# Altium project BMU_v50.PrjPcb (part 2 of 5)

## Sheet BMU_V50_CellBalanceTaps.SchDoc
size C
Used 2 times, as channels StringA/U_BMU_V50_CellBalancer/U_BMU_V50_CellBalanceTaps, StringB/U_BMU_V50_CellBalancer/U_BMU_V50_CellBalanceTaps. Parts and nets are listed once, with the designators drawn on the sheet.
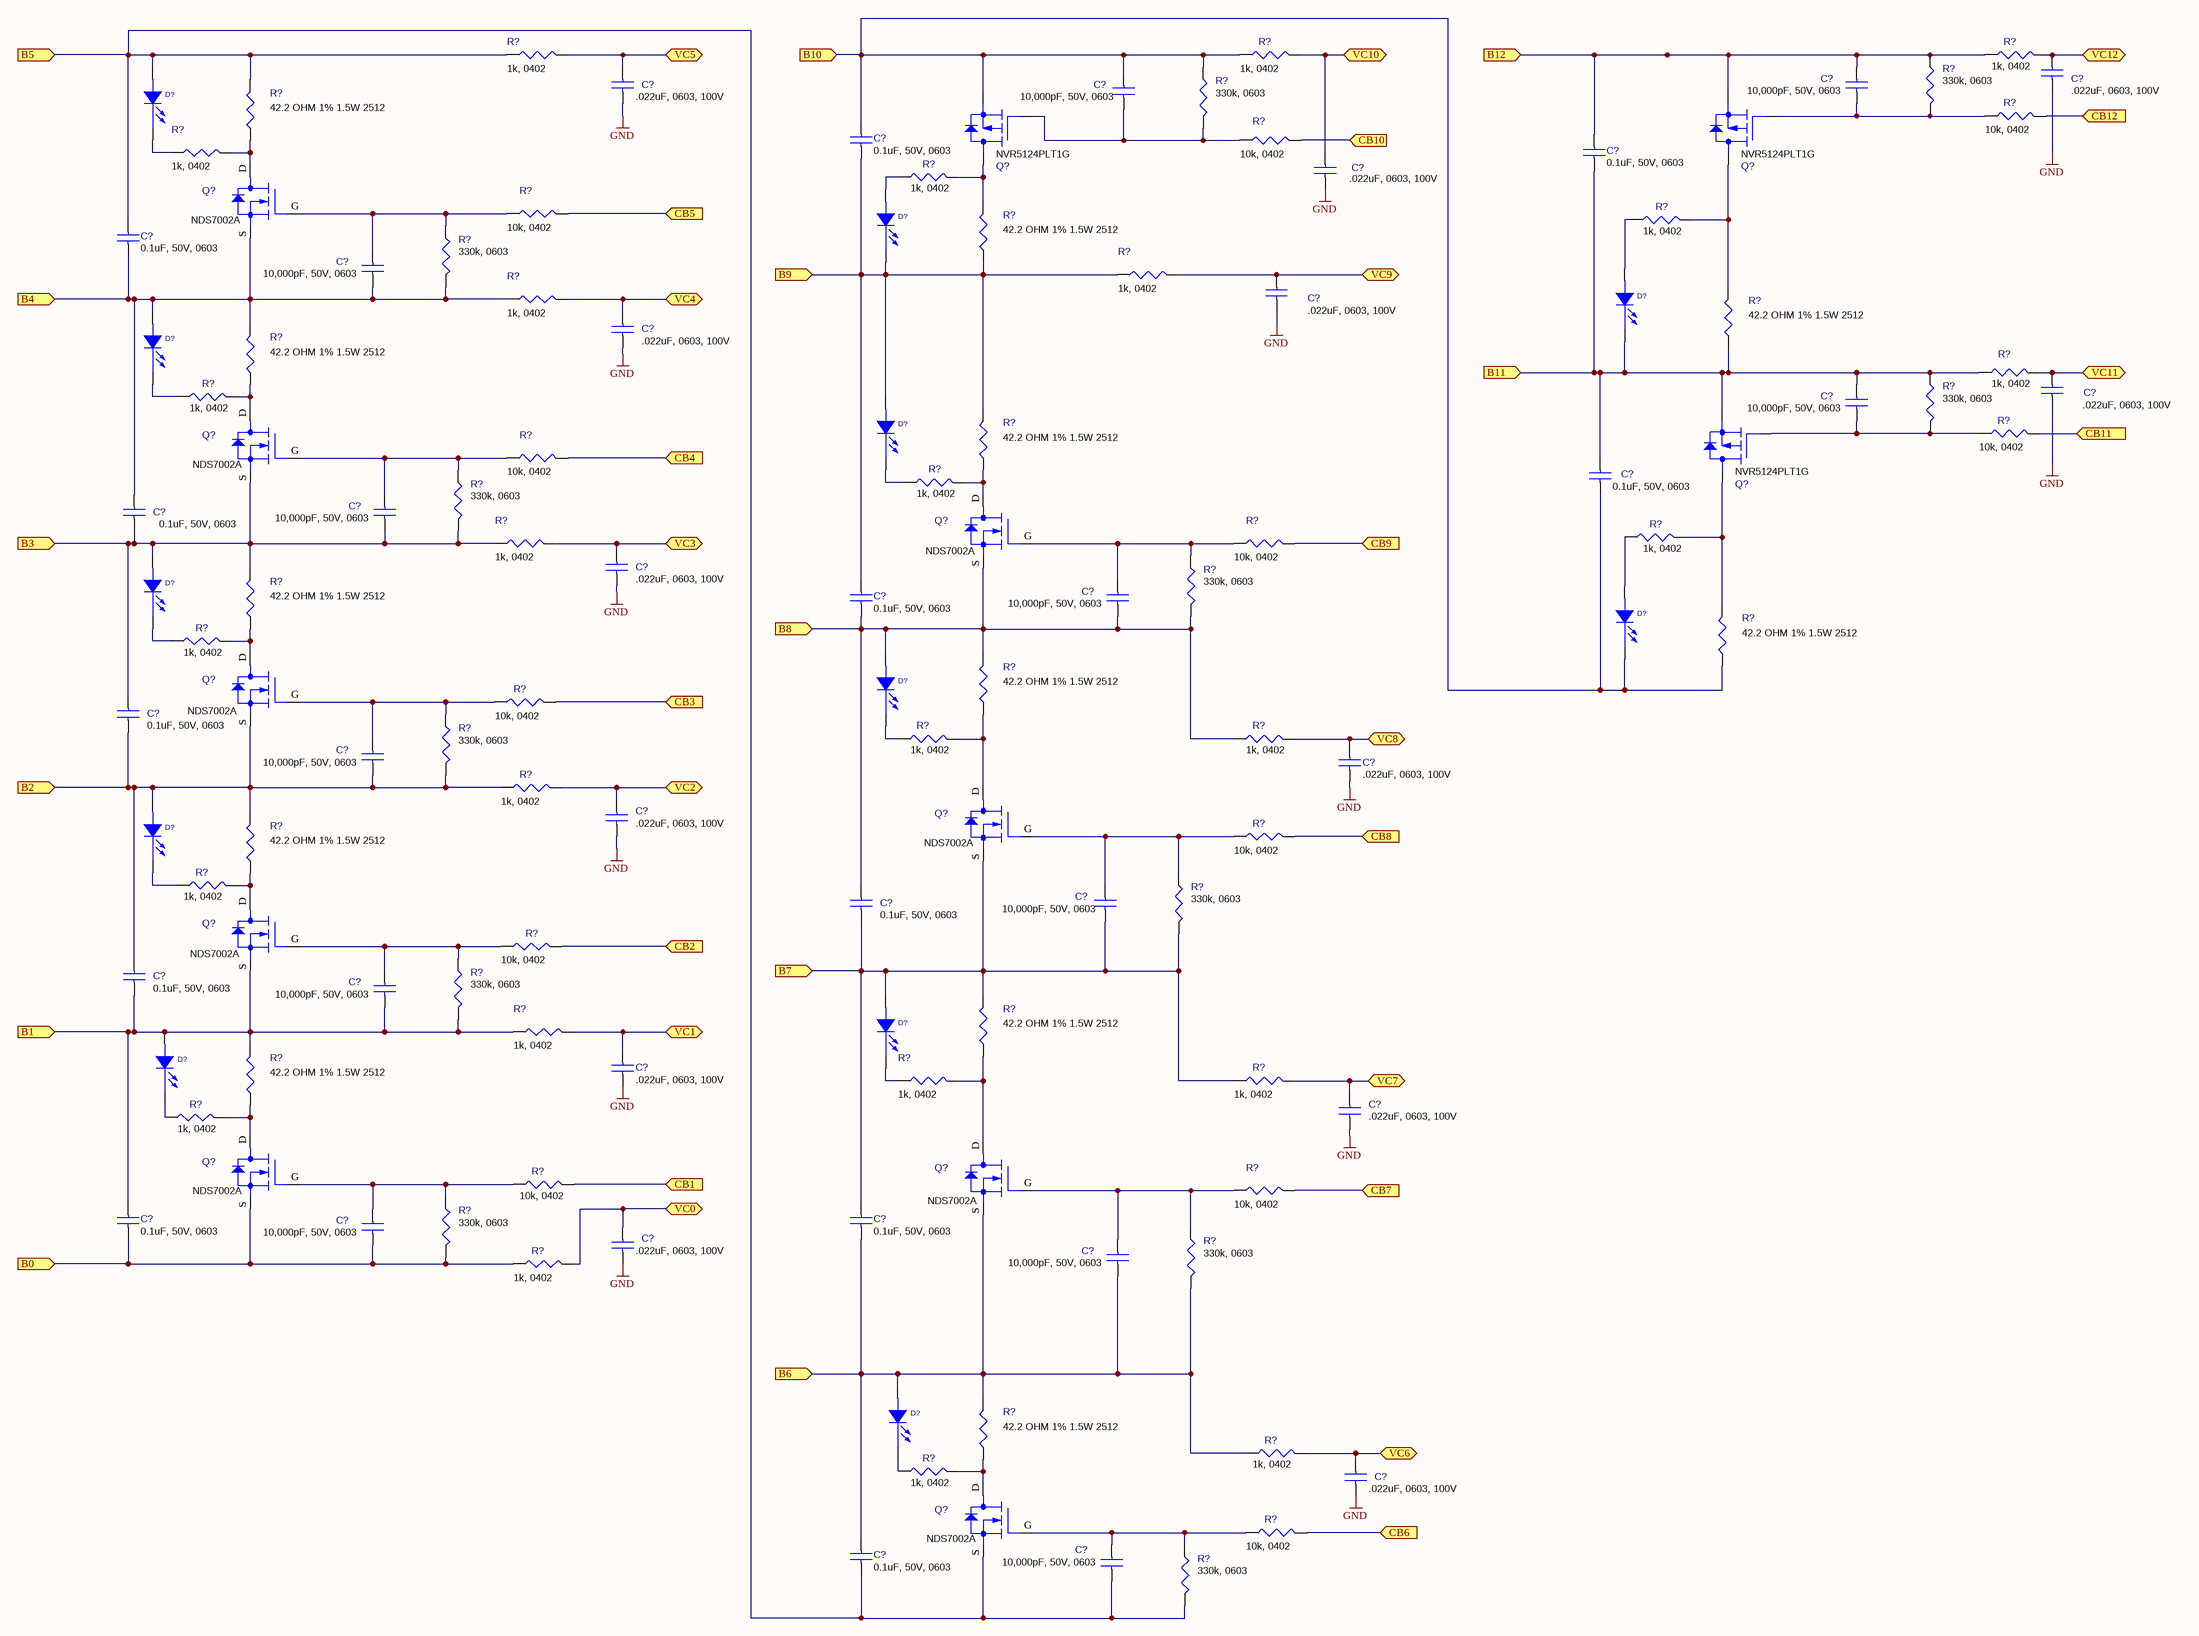
[diagram p5: BMU_V50_CellBalanceTaps.SchDoc]

### Parts
(Parts that share a designator on the sheet are numbered #1, #2 ... from top to bottom, then left to right.)
C?#1  .022uF, 0603, 100V  [C0603]
C?#2  .022uF, 0603, 100V  [C0603]
C?#3  10,000pF, 50V, 0603  [C0603]
C?#4  10,000pF, 50V, 0603  [C0603]
C?#5  0.1uF, 50V, 0603  [C0603]
C?#6  0.1uF, 50V, 0603  [C0603]
C?#7  .022uF, 0603, 100V  [C0603]
C?#8  0.1uF, 50V, 0603  [C0603]
C?#9  10,000pF, 50V, 0603  [C0603]
C?#10  .022uF, 0603, 100V  [C0603]
C?#11  .022uF, 0603, 100V  [C0603]
C?#12  .022uF, 0603, 100V  [C0603]
C?#13  10,000pF, 50V, 0603  [C0603]
C?#14  0.1uF, 50V, 0603  [C0603]
C?#15  0.1uF, 50V, 0603  [C0603]
C?#16  10,000pF, 50V, 0603  [C0603]
C?#17  .022uF, 0603, 100V  [C0603]
C?#18  0.1uF, 50V, 0603  [C0603]
C?#19  10,000pF, 50V, 0603  [C0603]
C?#20  0.1uF, 50V, 0603  [C0603]
C?#21  10,000pF, 50V, 0603  [C0603]
C?#22  .022uF, 0603, 100V  [C0603]
C?#23  .022uF, 0603, 100V  [C0603]
C?#24  0.1uF, 50V, 0603  [C0603]
C?#25  10,000pF, 50V, 0603  [C0603]
C?#26  0.1uF, 50V, 0603  [C0603]
C?#27  10,000pF, 50V, 0603  [C0603]
C?#28  .022uF, 0603, 100V  [C0603]
C?#29  .022uF, 0603, 100V  [C0603]
C?#30  0.1uF, 50V, 0603  [C0603]
C?#31  0.1uF, 50V, 0603  [C0603]
C?#32  10,000pF, 50V, 0603  [C0603]
C?#33  .022uF, 0603, 100V  [C0603]
C?#34  10,000pF, 50V, 0603  [C0603]
C?#35  .022uF, 0603, 100V  [C0603]
C?#36  0.1uF, 50V, 0603  [C0603]
C?#37  10,000pF, 50V, 0603  [C0603]
D?#1  SML-P12MTT86R, 0402  [D0402]  (value not drawn)
D?#2  SML-P12MTT86R, 0402  [D0402]  (value not drawn)
D?#3  SML-P12MTT86R, 0402  [D0402]  (value not drawn)
D?#4  SML-P12MTT86R, 0402  [D0402]  (value not drawn)
D?#5  SML-P12MTT86R, 0402  [D0402]  (value not drawn)
D?#6  SML-P12MTT86R, 0402  [D0402]  (value not drawn)
D?#7  SML-P12MTT86R, 0402  [D0402]  (value not drawn)
D?#8  SML-P12MTT86R, 0402  [D0402]  (value not drawn)
D?#9  SML-P12MTT86R, 0402  [D0402]  (value not drawn)
D?#10  SML-P12MTT86R, 0402  [D0402]  (value not drawn)
D?#11  SML-P12MTT86R, 0402  [D0402]  (value not drawn)
D?#12  SML-P12MTT86R, 0402  [D0402]  (value not drawn)
Q?#1  NVR5124PLT1G  [SOT-23]
Q?#2  NVR5124PLT1G  [SOT-23]
Q?#3  NDS7002A  [SOT-23]
Q?#4  NDS7002A  [SOT-23]
Q?#5  NVR5124PLT1G  [SOT-23]
Q?#6  NDS7002A  [SOT-23]
Q?#7  NDS7002A  [SOT-23]
Q?#8  NDS7002A  [SOT-23]
Q?#9  NDS7002A  [SOT-23]
Q?#10  NDS7002A  [SOT-23]
Q?#11  NDS7002A  [SOT-23]
Q?#12  NDS7002A  [SOT-23]
R?#1  1k, 0402  [R0402]
R?#2  1k, 0402  [R0402]
R?#3  330k, 0603  [R0603]
R?#4  1k, 0402  [R0402]
R?#5  330k, 0603  [R0603]
R?#6  42.2 OHM 1% 1.5W 2512  [2512]
R?#7  10k, 0402  [R0402]
R?#8  10k, 0402  [R0402]
R?#9  1k, 0402  [R0402]
R?#10  1k, 0402  [R0402]
R?#11  10k, 0402  [R0402]
R?#12  1k, 0402  [R0402]
R?#13  330k, 0603  [R0603]
R?#14  42.2 OHM 1% 1.5W 2512  [2512]
R?#15  1k, 0402  [R0402]
R?#16  1k, 0402  [R0402]
R?#17  42.2 OHM 1% 1.5W 2512  [2512]
R?#18  42.2 OHM 1% 1.5W 2512  [2512]
R?#19  330k, 0603  [R0603]
R?#20  1k, 0402  [R0402]
R?#21  1k, 0402  [R0402]
R?#22  10k, 0402  [R0402]
R?#23  42.2 OHM 1% 1.5W 2512  [2512]
R?#24  10k, 0402  [R0402]
R?#25  330k, 0603  [R0603]
R?#26  1k, 0402  [R0402]
R?#27  1k, 0402  [R0402]
R?#28  1k, 0402  [R0402]
R?#29  10k, 0402  [R0402]
R?#30  330k, 0603  [R0603]
R?#31  42.2 OHM 1% 1.5W 2512  [2512]
R?#32  1k, 0402  [R0402]
R?#33  42.2 OHM 1% 1.5W 2512  [2512]
R?#34  42.2 OHM 1% 1.5W 2512  [2512]
R?#35  10k, 0402  [R0402]
R?#36  330k, 0603  [R0603]
R?#37  1k, 0402  [R0402]
R?#38  1k, 0402  [R0402]
R?#39  1k, 0402  [R0402]
R?#40  10k, 0402  [R0402]
R?#41  42.2 OHM 1% 1.5W 2512  [2512]
R?#42  330k, 0603  [R0603]
R?#43  1k, 0402  [R0402]
R?#44  10k, 0402  [R0402]
R?#45  330k, 0603  [R0603]
R?#46  1k, 0402  [R0402]
R?#47  42.2 OHM 1% 1.5W 2512  [2512]
R?#48  42.2 OHM 1% 1.5W 2512  [2512]
R?#49  1k, 0402  [R0402]
R?#50  1k, 0402  [R0402]
R?#51  1k, 0402  [R0402]
R?#52  10k, 0402  [R0402]
R?#53  10k, 0402  [R0402]
R?#54  330k, 0603  [R0603]
R?#55  330k, 0603  [R0603]
R?#56  1k, 0402  [R0402]
R?#57  42.2 OHM 1% 1.5W 2512  [2512]
R?#58  1k, 0402  [R0402]
R?#59  1k, 0402  [R0402]
R?#60  10k, 0402  [R0402]
R?#61  330k, 0603  [R0603]

### Ports
B0 (in), B1 (in), B2 (in), B3 (in), B4 (in), B5 (in), B6 (in), B7 (in), B8 (in), B9 (in), B10 (in), B11 (in), B12 (in), CB1 (in), CB2 (in), CB3 (in), CB4 (in), CB5 (in), CB6 (in), CB7 (in), CB8 (in), CB9 (in), CB10 (in), CB11 (in), CB12 (in), VC0 (bidir), VC1 (bidir), VC2 (bidir), VC3 (bidir), VC4 (bidir), VC5 (bidir), VC6 (bidir), VC7 (bidir), VC8 (bidir), VC9 (bidir), VC10 (bidir), VC11 (bidir), VC12 (bidir)

### Nets
GND: C?#1.2 C?#2.2 C?#7.2 C?#10.2 C?#11.2 C?#12.2 C?#17.2 C?#22.2 C?#23.2 C?#28.2 C?#29.2 C?#33.2 C?#35.2
B0: C?#30.2 C?#32.2 Q?#10.S(SOURCE) R?#54.2 R?#56.1 ; port B0
B1: C?#26.2 C?#27.2 C?#30.1 D?#11.A(ANODE) Q?#9.S(SOURCE) R?#45.2 R?#46.1 R?#48.2 ; port B1
B2: C?#20.2 C?#21.2 C?#26.1 D?#9.A(ANODE) Q?#7.S(SOURCE) R?#36.2 R?#39.1 R?#41.2 ; port B2
B3: C?#15.2 C?#16.2 C?#20.1 D?#6.A(ANODE) Q?#4.S(SOURCE) R?#25.2 R?#28.1 R?#31.2 ; port B3
B4: C?#8.2 C?#9.2 C?#15.1 D?#4.A(ANODE) Q?#3.S(SOURCE) R?#13.2 R?#16.1 R?#18.2 ; port B4
B5: C?#8.1 C?#36.2 C?#37.2 D?#1.A(ANODE) Q?#12.S(SOURCE) R?#1.1 R?#6.2 R?#61.2 ; port B5
B6: C?#31.2 C?#34.2 C?#36.1 D?#12.A(ANODE) Q?#11.S(SOURCE) R?#55.2 R?#57.2 R?#58.1 ; port B6
B7: C?#24.2 C?#25.2 C?#31.1 D?#10.A(ANODE) Q?#8.S(SOURCE) R?#42.2 R?#47.2 R?#50.1 ; port B7
B8: C?#18.2 C?#19.2 C?#24.1 D?#8.A(ANODE) Q?#6.S(SOURCE) R?#30.2 R?#34.2 R?#38.1 ; port B8
B9: C?#5.2 C?#18.1 D?#2.C(CATHODE) D?#5.A(ANODE) R?#14.1 R?#15.1 R?#23.2 ; port B9
B10: C?#4.1 C?#5.1 C?#14.2 D?#7.C(CATHODE) Q?#1.S R?#2.1 R?#5.1 R?#33.1 ; port B10
B11: C?#6.2 C?#13.1 C?#14.1 D?#3.C(CATHODE) Q?#5.S R?#17.1 R?#19.1 R?#20.1 ; port B11
B12: C?#3.1 C?#6.1 Q?#2.S R?#3.1 R?#4.1 ; port B12
CB1: R?#52.2 ; port CB1
CB2: R?#44.2 ; port CB2
CB3: R?#35.2 ; port CB3
CB4: R?#24.2 ; port CB4
CB5: R?#11.2 ; port CB5
CB6: R?#60.2 ; port CB6
CB7: R?#53.2 ; port CB7
CB8: R?#40.2 ; port CB8
CB9: R?#29.2 ; port CB9
CB10: R?#8.2 ; port CB10
CB11: R?#22.2 ; port CB11
CB12: R?#7.2 ; port CB12
VC0: C?#33.1 R?#56.2 ; port VC0
VC1: C?#28.1 R?#46.2 ; port VC1
VC2: C?#23.1 R?#39.2 ; port VC2
VC3: C?#17.1 R?#28.2 ; port VC3
VC4: C?#11.1 R?#16.2 ; port VC4
VC5: C?#2.1 R?#1.2 ; port VC5
VC6: C?#35.1 R?#58.2 ; port VC6
VC7: C?#29.1 R?#50.2 ; port VC7
VC8: C?#22.1 R?#38.2 ; port VC8
VC9: C?#10.1 R?#15.2 ; port VC9
VC10: C?#7.1 R?#2.2 ; port VC10
VC11: C?#12.1 R?#20.2 ; port VC11
VC12: C?#1.1 R?#4.2 ; port VC12
NetC?#3_2: C?#3.2 Q?#2.G R?#3.2 R?#7.1
NetC?#4_2: C?#4.2 Q?#1.G R?#5.2 R?#8.1
NetC?#9_1: C?#9.1 Q?#3.G(GATE) R?#11.1 R?#13.1
NetC?#13_2: C?#13.2 Q?#5.G R?#19.2 R?#22.1
NetC?#16_1: C?#16.1 Q?#4.G(GATE) R?#24.1 R?#25.1
NetC?#19_1: C?#19.1 Q?#6.G(GATE) R?#29.1 R?#30.1
NetC?#21_1: C?#21.1 Q?#7.G(GATE) R?#35.1 R?#36.1
NetC?#25_1: C?#25.1 Q?#8.G(GATE) R?#40.1 R?#42.1
NetC?#27_1: C?#27.1 Q?#9.G(GATE) R?#44.1 R?#45.1
NetC?#32_1: C?#32.1 Q?#10.G(GATE) R?#52.1 R?#54.1
NetC?#34_1: C?#34.1 Q?#11.G(GATE) R?#53.1 R?#55.1
NetC?#37_1: C?#37.1 Q?#12.G(GATE) R?#60.1 R?#61.1
NetD?#1_C: D?#1.C(CATHODE) R?#9.1
NetD?#2_A: D?#2.A(ANODE) R?#10.1
NetD?#3_A: D?#3.A(ANODE) R?#12.1
NetD?#4_C: D?#4.C(CATHODE) R?#21.1
NetD?#5_C: D?#5.C(CATHODE) R?#26.1
NetD?#6_C: D?#6.C(CATHODE) R?#32.1
NetD?#7_A: D?#7.A(ANODE) R?#27.1
NetD?#8_C: D?#8.C(CATHODE) R?#37.1
NetD?#9_C: D?#9.C(CATHODE) R?#43.1
NetD?#10_C: D?#10.C(CATHODE) R?#49.1
NetD?#11_C: D?#11.C(CATHODE) R?#51.1
NetD?#12_C: D?#12.C(CATHODE) R?#59.1
NetQ?#1_D: Q?#1.D R?#10.2 R?#14.2
NetQ?#2_D: Q?#2.D R?#12.2 R?#17.2
NetQ?#3_D: Q?#3.D(DRAIN) R?#6.1 R?#9.2
NetQ?#4_D: Q?#4.D(DRAIN) R?#18.1 R?#21.2
NetQ?#5_D: Q?#5.D R?#27.2 R?#33.2
NetQ?#6_D: Q?#6.D(DRAIN) R?#23.1 R?#26.2
NetQ?#7_D: Q?#7.D(DRAIN) R?#31.1 R?#32.2
NetQ?#8_D: Q?#8.D(DRAIN) R?#34.1 R?#37.2
NetQ?#9_D: Q?#9.D(DRAIN) R?#41.1 R?#43.2
NetQ?#10_D: Q?#10.D(DRAIN) R?#48.1 R?#51.2
NetQ?#11_D: Q?#11.D(DRAIN) R?#47.1 R?#49.2
NetQ?#12_D: Q?#12.D(DRAIN) R?#57.1 R?#59.2

### Channels
StringA/U_BMU_V50_CellBalancer/U_BMU_V50_CellBalanceTaps: designators C?=C?_StringA_U_BMU_V50_CellBalancer_U_BMU_V50_CellBalanceTaps#33 C?=C?_StringA_U_BMU_V50_CellBalancer_U_BMU_V50_CellBalanceTaps#17 C?=C?_StringA_U_BMU_V50_CellBalancer_U_BMU_V50_CellBalanceTaps#32 C?=C?_StringA_U_BMU_V50_CellBalancer_U_BMU_V50_CellBalanceTaps#21 C?=C?_StringA_U_BMU_V50_CellBalancer_U_BMU_V50_CellBalanceTaps#23 C?=C?_StringA_U_BMU_V50_CellBalancer_U_BMU_V50_CellBalanceTaps#27 C?=C?_StringA_U_BMU_V50_CellBalancer_U_BMU_V50_CellBalanceTaps#28 C?=C?_StringA_U_BMU_V50_CellBalancer_U_BMU_V50_CellBalanceTaps#2 C?=C?_StringA_U_BMU_V50_CellBalancer_U_BMU_V50_CellBalanceTaps#9 C?=C?_StringA_U_BMU_V50_CellBalancer_U_BMU_V50_CellBalanceTaps#11 C?=C?_StringA_U_BMU_V50_CellBalancer_U_BMU_V50_CellBalanceTaps#16 C?=C?_StringA_U_BMU_V50_CellBalancer_U_BMU_V50_CellBalanceTaps#22 C?=C?_StringA_U_BMU_V50_CellBalancer_U_BMU_V50_CellBalanceTaps#37 C?=C?_StringA_U_BMU_V50_CellBalancer_U_BMU_V50_CellBalanceTaps#25 C?=C?_StringA_U_BMU_V50_CellBalancer_U_BMU_V50_CellBalanceTaps#29 C?=C?_StringA_U_BMU_V50_CellBalancer_U_BMU_V50_CellBalanceTaps#34 C?=C?_StringA_U_BMU_V50_CellBalancer_U_BMU_V50_CellBalanceTaps#35 C?=C?_StringA_U_BMU_V50_CellBalancer_U_BMU_V50_CellBalanceTaps#19 C?=C?_StringA_U_BMU_V50_CellBalancer_U_BMU_V50_CellBalanceTaps#4 C?=C?_StringA_U_BMU_V50_CellBalancer_U_BMU_V50_CellBalanceTaps#10 C?=C?_StringA_U_BMU_V50_CellBalancer_U_BMU_V50_CellBalanceTaps#7 C?=C?_StringA_U_BMU_V50_CellBalancer_U_BMU_V50_CellBalanceTaps#5 C?=C?_StringA_U_BMU_V50_CellBalancer_U_BMU_V50_CellBalanceTaps#18 C?=C?_StringA_U_BMU_V50_CellBalancer_U_BMU_V50_CellBalanceTaps#24 C?=C?_StringA_U_BMU_V50_CellBalancer_U_BMU_V50_CellBalanceTaps#31 C?=C?_StringA_U_BMU_V50_CellBalancer_U_BMU_V50_CellBalanceTaps#36 C?=C?_StringA_U_BMU_V50_CellBalancer_U_BMU_V50_CellBalanceTaps#30 C?=C?_StringA_U_BMU_V50_CellBalancer_U_BMU_V50_CellBalanceTaps#26 C?=C?_StringA_U_BMU_V50_CellBalancer_U_BMU_V50_CellBalanceTaps#20 C?=C?_StringA_U_BMU_V50_CellBalancer_U_BMU_V50_CellBalanceTaps#15 C?=C?_StringA_U_BMU_V50_CellBalancer_U_BMU_V50_CellBalanceTaps#8 C?=C?_StringA_U_BMU_V50_CellBalancer_U_BMU_V50_CellBalanceTaps#13 C?=C?_StringA_U_BMU_V50_CellBalancer_U_BMU_V50_CellBalanceTaps#12 C?=C?_StringA_U_BMU_V50_CellBalancer_U_BMU_V50_CellBalanceTaps#3 C?=C?_StringA_U_BMU_V50_CellBalancer_U_BMU_V50_CellBalanceTaps#1 C?=C?_StringA_U_BMU_V50_CellBalancer_U_BMU_V50_CellBalanceTaps#14 C?=C?_StringA_U_BMU_V50_CellBalancer_U_BMU_V50_CellBalanceTaps#6 D?=D?_StringA_U_BMU_V50_CellBalancer_U_BMU_V50_CellBalanceTaps#11 D?=D?_StringA_U_BMU_V50_CellBalancer_U_BMU_V50_CellBalanceTaps#9 D?=D?_StringA_U_BMU_V50_CellBalancer_U_BMU_V50_CellBalanceTaps#6 D?=D?_StringA_U_BMU_V50_CellBalancer_U_BMU_V50_CellBalanceTaps#4 D?=D?_StringA_U_BMU_V50_CellBalancer_U_BMU_V50_CellBalanceTaps#1 D?=D?_StringA_U_BMU_V50_CellBalancer_U_BMU_V50_CellBalanceTaps#12 D?=D?_StringA_U_BMU_V50_CellBalancer_U_BMU_V50_CellBalanceTaps#10 D?=D?_StringA_U_BMU_V50_CellBalancer_U_BMU_V50_CellBalanceTaps#8 D?=D?_StringA_U_BMU_V50_CellBalancer_U_BMU_V50_CellBalanceTaps#5 D?=D?_StringA_U_BMU_V50_CellBalancer_U_BMU_V50_CellBalanceTaps#2 D?=D?_StringA_U_BMU_V50_CellBalancer_U_BMU_V50_CellBalanceTaps#7 D?=D?_StringA_U_BMU_V50_CellBalancer_U_BMU_V50_CellBalanceTaps#3 Q?=Q?_StringA_U_BMU_V50_CellBalancer_U_BMU_V50_CellBalanceTaps#7 Q?=Q?_StringA_U_BMU_V50_CellBalancer_U_BMU_V50_CellBalanceTaps#10 Q?=Q?_StringA_U_BMU_V50_CellBalancer_U_BMU_V50_CellBalanceTaps#9 Q?=Q?_StringA_U_BMU_V50_CellBalancer_U_BMU_V50_CellBalanceTaps#4 Q?=Q?_StringA_U_BMU_V50_CellBalancer_U_BMU_V50_CellBalanceTaps#8 Q?=Q?_StringA_U_BMU_V50_CellBalancer_U_BMU_V50_CellBalanceTaps#12 Q?=Q?_StringA_U_BMU_V50_CellBalancer_U_BMU_V50_CellBalanceTaps#11 Q?=Q?_StringA_U_BMU_V50_CellBalancer_U_BMU_V50_CellBalanceTaps#6 Q?=Q?_StringA_U_BMU_V50_CellBalancer_U_BMU_V50_CellBalanceTaps#1 Q?=Q?_StringA_U_BMU_V50_CellBalancer_U_BMU_V50_CellBalanceTaps#3 Q?=Q?_StringA_U_BMU_V50_CellBalancer_U_BMU_V50_CellBalanceTaps#5 Q?=Q?_StringA_U_BMU_V50_CellBalancer_U_BMU_V50_CellBalanceTaps#2 R?=R?_StringA_U_BMU_V50_CellBalancer_U_BMU_V50_CellBalanceTaps#45 R?=R?_StringA_U_BMU_V50_CellBalancer_U_BMU_V50_CellBalanceTaps#44 R?=R?_StringA_U_BMU_V50_CellBalancer_U_BMU_V50_CellBalanceTaps#41 R?=R?_StringA_U_BMU_V50_CellBalancer_U_BMU_V50_CellBalanceTaps#51 R?=R?_StringA_U_BMU_V50_CellBalancer_U_BMU_V50_CellBalanceTaps#36 R?=R?_StringA_U_BMU_V50_CellBalancer_U_BMU_V50_CellBalanceTaps#28 R?=R?_StringA_U_BMU_V50_CellBalancer_U_BMU_V50_CellBalanceTaps#35 R?=R?_StringA_U_BMU_V50_CellBalancer_U_BMU_V50_CellBalanceTaps#46 R?=R?_StringA_U_BMU_V50_CellBalancer_U_BMU_V50_CellBalanceTaps#56 R?=R?_StringA_U_BMU_V50_CellBalancer_U_BMU_V50_CellBalanceTaps#43 R?=R?_StringA_U_BMU_V50_CellBalancer_U_BMU_V50_CellBalanceTaps#31 R?=R?_StringA_U_BMU_V50_CellBalancer_U_BMU_V50_CellBalanceTaps#54 R?=R?_StringA_U_BMU_V50_CellBalancer_U_BMU_V50_CellBalanceTaps#52 R?=R?_StringA_U_BMU_V50_CellBalancer_U_BMU_V50_CellBalanceTaps#32 R?=R?_StringA_U_BMU_V50_CellBalancer_U_BMU_V50_CellBalanceTaps#48 R?=R?_StringA_U_BMU_V50_CellBalancer_U_BMU_V50_CellBalanceTaps#39 R?=R?_StringA_U_BMU_V50_CellBalancer_U_BMU_V50_CellBalanceTaps#25 R?=R?_StringA_U_BMU_V50_CellBalancer_U_BMU_V50_CellBalanceTaps#24 R?=R?_StringA_U_BMU_V50_CellBalancer_U_BMU_V50_CellBalanceTaps#18 R?=R?_StringA_U_BMU_V50_CellBalancer_U_BMU_V50_CellBalanceTaps#13 R?=R?_StringA_U_BMU_V50_CellBalancer_U_BMU_V50_CellBalanceTaps#1 R?=R?_StringA_U_BMU_V50_CellBalancer_U_BMU_V50_CellBalanceTaps#11 R?=R?_StringA_U_BMU_V50_CellBalancer_U_BMU_V50_CellBalanceTaps#21 R?=R?_StringA_U_BMU_V50_CellBalancer_U_BMU_V50_CellBalanceTaps#6 R?=R?_StringA_U_BMU_V50_CellBalancer_U_BMU_V50_CellBalanceTaps#9 R?=R?_StringA_U_BMU_V50_CellBalancer_U_BMU_V50_CellBalanceTaps#16 R?=R?_StringA_U_BMU_V50_CellBalancer_U_BMU_V50_CellBalanceTaps#55 R?=R?_StringA_U_BMU_V50_CellBalancer_U_BMU_V50_CellBalanceTaps#53 R?=R?_StringA_U_BMU_V50_CellBalancer_U_BMU_V50_CellBalanceTaps#47 R?=R?_StringA_U_BMU_V50_CellBalancer_U_BMU_V50_CellBalanceTaps#59 R?=R?_StringA_U_BMU_V50_CellBalancer_U_BMU_V50_CellBalanceTaps#42 R?=R?_StringA_U_BMU_V50_CellBalancer_U_BMU_V50_CellBalanceTaps#38 R?=R?_StringA_U_BMU_V50_CellBalancer_U_BMU_V50_CellBalanceTaps#40 R?=R?_StringA_U_BMU_V50_CellBalancer_U_BMU_V50_CellBalanceTaps#58 R?=R?_StringA_U_BMU_V50_CellBalancer_U_BMU_V50_CellBalanceTaps#49 R?=R?_StringA_U_BMU_V50_CellBalancer_U_BMU_V50_CellBalanceTaps#34 R?=R?_StringA_U_BMU_V50_CellBalancer_U_BMU_V50_CellBalanceTaps#61 R?=R?_StringA_U_BMU_V50_CellBalancer_U_BMU_V50_CellBalanceTaps#60 R?=R?_StringA_U_BMU_V50_CellBalancer_U_BMU_V50_CellBalanceTaps#37 R?=R?_StringA_U_BMU_V50_CellBalancer_U_BMU_V50_CellBalanceTaps#57 R?=R?_StringA_U_BMU_V50_CellBalancer_U_BMU_V50_CellBalanceTaps#50 R?=R?_StringA_U_BMU_V50_CellBalancer_U_BMU_V50_CellBalanceTaps#30 R?=R?_StringA_U_BMU_V50_CellBalancer_U_BMU_V50_CellBalanceTaps#29 R?=R?_StringA_U_BMU_V50_CellBalancer_U_BMU_V50_CellBalanceTaps#23 R?=R?_StringA_U_BMU_V50_CellBalancer_U_BMU_V50_CellBalanceTaps#26 R?=R?_StringA_U_BMU_V50_CellBalancer_U_BMU_V50_CellBalanceTaps#5 R?=R?_StringA_U_BMU_V50_CellBalancer_U_BMU_V50_CellBalanceTaps#10 R?=R?_StringA_U_BMU_V50_CellBalancer_U_BMU_V50_CellBalanceTaps#14 R?=R?_StringA_U_BMU_V50_CellBalancer_U_BMU_V50_CellBalanceTaps#8 R?=R?_StringA_U_BMU_V50_CellBalancer_U_BMU_V50_CellBalanceTaps#15 R?=R?_StringA_U_BMU_V50_CellBalancer_U_BMU_V50_CellBalanceTaps#2 R?=R?_StringA_U_BMU_V50_CellBalancer_U_BMU_V50_CellBalanceTaps#19 R?=R?_StringA_U_BMU_V50_CellBalancer_U_BMU_V50_CellBalanceTaps#27 R?=R?_StringA_U_BMU_V50_CellBalancer_U_BMU_V50_CellBalanceTaps#33 R?=R?_StringA_U_BMU_V50_CellBalancer_U_BMU_V50_CellBalanceTaps#20 R?=R?_StringA_U_BMU_V50_CellBalancer_U_BMU_V50_CellBalanceTaps#3 R?=R?_StringA_U_BMU_V50_CellBalancer_U_BMU_V50_CellBalanceTaps#12 R?=R?_StringA_U_BMU_V50_CellBalancer_U_BMU_V50_CellBalanceTaps#17 R?=R?_StringA_U_BMU_V50_CellBalancer_U_BMU_V50_CellBalanceTaps#7 R?=R?_StringA_U_BMU_V50_CellBalancer_U_BMU_V50_CellBalanceTaps#4 R?=R?_StringA_U_BMU_V50_CellBalancer_U_BMU_V50_CellBalanceTaps#22; ports B0=NetC?_StringA_U_BMU_V50_CellBalancer_U_BMU_V50_CellBalanceTaps#30_2 B1=NetC?_StringA_U_BMU_V50_CellBalancer_U_BMU_V50_CellBalanceTaps#26_2 B2=NetC?_StringA_U_BMU_V50_CellBalancer_U_BMU_V50_CellBalanceTaps#20_2 B3=NetC?_StringA_U_BMU_V50_CellBalancer_U_BMU_V50_CellBalanceTaps#15_2 B4=NetC?_StringA_U_BMU_V50_CellBalancer_U_BMU_V50_CellBalanceTaps#8_2 B5=NetC?_StringA_U_BMU_V50_CellBalancer_U_BMU_V50_CellBalanceTaps#8_1 B6=NetC?_StringA_U_BMU_V50_CellBalancer_U_BMU_V50_CellBalanceTaps#31_2 B7=NetC?_StringA_U_BMU_V50_CellBalancer_U_BMU_V50_CellBalanceTaps#24_2 B8=NetC?_StringA_U_BMU_V50_CellBalancer_U_BMU_V50_CellBalanceTaps#18_2 B9=NetC?_StringA_U_BMU_V50_CellBalancer_U_BMU_V50_CellBalanceTaps#5_2 B10=NetC?_StringA_U_BMU_V50_CellBalancer_U_BMU_V50_CellBalanceTaps#4_1 B11=NetC?_StringA_U_BMU_V50_CellBalancer_U_BMU_V50_CellBalanceTaps#6_2 B12=NetC?_StringA_U_BMU_V50_CellBalancer_U_BMU_V50_CellBalanceTaps#3_1 CB1=NetR?_StringA_U_BMU_V50_CellBalancer_U_BMU_V50_CellBalanceTaps#52_2 CB2=NetR?_StringA_U_BMU_V50_CellBalancer_U_BMU_V50_CellBalanceTaps#44_2 CB3=NetR?_StringA_U_BMU_V50_CellBalancer_U_BMU_V50_CellBalanceTaps#35_2 CB4=NetR?_StringA_U_BMU_V50_CellBalancer_U_BMU_V50_CellBalanceTaps#24_2 CB5=NetR?_StringA_U_BMU_V50_CellBalancer_U_BMU_V50_CellBalanceTaps#11_2 CB6=NetR?_StringA_U_BMU_V50_CellBalancer_U_BMU_V50_CellBalanceTaps#60_2 CB7=NetR?_StringA_U_BMU_V50_CellBalancer_U_BMU_V50_CellBalanceTaps#53_2 CB8=NetR?_StringA_U_BMU_V50_CellBalancer_U_BMU_V50_CellBalanceTaps#40_2 CB9=NetR?_StringA_U_BMU_V50_CellBalancer_U_BMU_V50_CellBalanceTaps#29_2 CB10=NetR?_StringA_U_BMU_V50_CellBalancer_U_BMU_V50_CellBalanceTaps#8_2 CB11=NetR?_StringA_U_BMU_V50_CellBalancer_U_BMU_V50_CellBalanceTaps#22_2 CB12=NetR?_StringA_U_BMU_V50_CellBalancer_U_BMU_V50_CellBalanceTaps#7_2 VC0=NetC?_StringA_U_BMU_V50_CellBalancer_U_BMU_V50_CellBalanceTaps#33_1 VC1=NetC?_StringA_U_BMU_V50_CellBalancer_U_BMU_V50_CellBalanceTaps#28_1 VC2=NetC?_StringA_U_BMU_V50_CellBalancer_U_BMU_V50_CellBalanceTaps#23_1 VC3=NetC?_StringA_U_BMU_V50_CellBalancer_U_BMU_V50_CellBalanceTaps#17_1 VC4=NetC?_StringA_U_BMU_V50_CellBalancer_U_BMU_V50_CellBalanceTaps#11_1 VC5=NetC?_StringA_U_BMU_V50_CellBalancer_U_BMU_V50_CellBalanceTaps#2_1 VC6=NetC?_StringA_U_BMU_V50_CellBalancer_U_BMU_V50_CellBalanceTaps#35_1 VC7=NetC?_StringA_U_BMU_V50_CellBalancer_U_BMU_V50_CellBalanceTaps#29_1 VC8=NetC?_StringA_U_BMU_V50_CellBalancer_U_BMU_V50_CellBalanceTaps#22_1 VC9=NetC?_StringA_U_BMU_V50_CellBalancer_U_BMU_V50_CellBalanceTaps#10_1 VC10=NetC?_StringA_U_BMU_V50_CellBalancer_U_BMU_V50_CellBalanceTaps#7_1 VC11=NetC?_StringA_U_BMU_V50_CellBalancer_U_BMU_V50_CellBalanceTaps#12_1 VC12=NetC?_StringA_U_BMU_V50_CellBalancer_U_BMU_V50_CellBalanceTaps#1_1
StringB/U_BMU_V50_CellBalancer/U_BMU_V50_CellBalanceTaps: designators C?=C?_StringB_U_BMU_V50_CellBalancer_U_BMU_V50_CellBalanceTaps#33 C?=C?_StringB_U_BMU_V50_CellBalancer_U_BMU_V50_CellBalanceTaps#17 C?=C?_StringB_U_BMU_V50_CellBalancer_U_BMU_V50_CellBalanceTaps#32 C?=C?_StringB_U_BMU_V50_CellBalancer_U_BMU_V50_CellBalanceTaps#21 C?=C?_StringB_U_BMU_V50_CellBalancer_U_BMU_V50_CellBalanceTaps#23 C?=C?_StringB_U_BMU_V50_CellBalancer_U_BMU_V50_CellBalanceTaps#27 C?=C?_StringB_U_BMU_V50_CellBalancer_U_BMU_V50_CellBalanceTaps#28 C?=C?_StringB_U_BMU_V50_CellBalancer_U_BMU_V50_CellBalanceTaps#2 C?=C?_StringB_U_BMU_V50_CellBalancer_U_BMU_V50_CellBalanceTaps#9 C?=C?_StringB_U_BMU_V50_CellBalancer_U_BMU_V50_CellBalanceTaps#11 C?=C?_StringB_U_BMU_V50_CellBalancer_U_BMU_V50_CellBalanceTaps#16 C?=C?_StringB_U_BMU_V50_CellBalancer_U_BMU_V50_CellBalanceTaps#22 C?=C?_StringB_U_BMU_V50_CellBalancer_U_BMU_V50_CellBalanceTaps#37 C?=C?_StringB_U_BMU_V50_CellBalancer_U_BMU_V50_CellBalanceTaps#25 C?=C?_StringB_U_BMU_V50_CellBalancer_U_BMU_V50_CellBalanceTaps#29 C?=C?_StringB_U_BMU_V50_CellBalancer_U_BMU_V50_CellBalanceTaps#34 C?=C?_StringB_U_BMU_V50_CellBalancer_U_BMU_V50_CellBalanceTaps#35 C?=C?_StringB_U_BMU_V50_CellBalancer_U_BMU_V50_CellBalanceTaps#19 C?=C?_StringB_U_BMU_V50_CellBalancer_U_BMU_V50_CellBalanceTaps#4 C?=C?_StringB_U_BMU_V50_CellBalancer_U_BMU_V50_CellBalanceTaps#10 C?=C?_StringB_U_BMU_V50_CellBalancer_U_BMU_V50_CellBalanceTaps#7 C?=C?_StringB_U_BMU_V50_CellBalancer_U_BMU_V50_CellBalanceTaps#5 C?=C?_StringB_U_BMU_V50_CellBalancer_U_BMU_V50_CellBalanceTaps#18 C?=C?_StringB_U_BMU_V50_CellBalancer_U_BMU_V50_CellBalanceTaps#24 C?=C?_StringB_U_BMU_V50_CellBalancer_U_BMU_V50_CellBalanceTaps#31 C?=C?_StringB_U_BMU_V50_CellBalancer_U_BMU_V50_CellBalanceTaps#36 C?=C?_StringB_U_BMU_V50_CellBalancer_U_BMU_V50_CellBalanceTaps#30 C?=C?_StringB_U_BMU_V50_CellBalancer_U_BMU_V50_CellBalanceTaps#26 C?=C?_StringB_U_BMU_V50_CellBalancer_U_BMU_V50_CellBalanceTaps#20 C?=C?_StringB_U_BMU_V50_CellBalancer_U_BMU_V50_CellBalanceTaps#15 C?=C?_StringB_U_BMU_V50_CellBalancer_U_BMU_V50_CellBalanceTaps#8 C?=C?_StringB_U_BMU_V50_CellBalancer_U_BMU_V50_CellBalanceTaps#13 C?=C?_StringB_U_BMU_V50_CellBalancer_U_BMU_V50_CellBalanceTaps#12 C?=C?_StringB_U_BMU_V50_CellBalancer_U_BMU_V50_CellBalanceTaps#3 C?=C?_StringB_U_BMU_V50_CellBalancer_U_BMU_V50_CellBalanceTaps#1 C?=C?_StringB_U_BMU_V50_CellBalancer_U_BMU_V50_CellBalanceTaps#14 C?=C?_StringB_U_BMU_V50_CellBalancer_U_BMU_V50_CellBalanceTaps#6 D?=D?_StringB_U_BMU_V50_CellBalancer_U_BMU_V50_CellBalanceTaps#11 D?=D?_StringB_U_BMU_V50_CellBalancer_U_BMU_V50_CellBalanceTaps#9 D?=D?_StringB_U_BMU_V50_CellBalancer_U_BMU_V50_CellBalanceTaps#6 D?=D?_StringB_U_BMU_V50_CellBalancer_U_BMU_V50_CellBalanceTaps#4 D?=D?_StringB_U_BMU_V50_CellBalancer_U_BMU_V50_CellBalanceTaps#1 D?=D?_StringB_U_BMU_V50_CellBalancer_U_BMU_V50_CellBalanceTaps#12 D?=D?_StringB_U_BMU_V50_CellBalancer_U_BMU_V50_CellBalanceTaps#10 D?=D?_StringB_U_BMU_V50_CellBalancer_U_BMU_V50_CellBalanceTaps#8 D?=D?_StringB_U_BMU_V50_CellBalancer_U_BMU_V50_CellBalanceTaps#5 D?=D?_StringB_U_BMU_V50_CellBalancer_U_BMU_V50_CellBalanceTaps#2 D?=D?_StringB_U_BMU_V50_CellBalancer_U_BMU_V50_CellBalanceTaps#7 D?=D?_StringB_U_BMU_V50_CellBalancer_U_BMU_V50_CellBalanceTaps#3 Q?=Q?_StringB_U_BMU_V50_CellBalancer_U_BMU_V50_CellBalanceTaps#7 Q?=Q?_StringB_U_BMU_V50_CellBalancer_U_BMU_V50_CellBalanceTaps#10 Q?=Q?_StringB_U_BMU_V50_CellBalancer_U_BMU_V50_CellBalanceTaps#9 Q?=Q?_StringB_U_BMU_V50_CellBalancer_U_BMU_V50_CellBalanceTaps#4 Q?=Q?_StringB_U_BMU_V50_CellBalancer_U_BMU_V50_CellBalanceTaps#8 Q?=Q?_StringB_U_BMU_V50_CellBalancer_U_BMU_V50_CellBalanceTaps#12 Q?=Q?_StringB_U_BMU_V50_CellBalancer_U_BMU_V50_CellBalanceTaps#11 Q?=Q?_StringB_U_BMU_V50_CellBalancer_U_BMU_V50_CellBalanceTaps#6 Q?=Q?_StringB_U_BMU_V50_CellBalancer_U_BMU_V50_CellBalanceTaps#1 Q?=Q?_StringB_U_BMU_V50_CellBalancer_U_BMU_V50_CellBalanceTaps#3 Q?=Q?_StringB_U_BMU_V50_CellBalancer_U_BMU_V50_CellBalanceTaps#5 Q?=Q?_StringB_U_BMU_V50_CellBalancer_U_BMU_V50_CellBalanceTaps#2 R?=R?_StringB_U_BMU_V50_CellBalancer_U_BMU_V50_CellBalanceTaps#45 R?=R?_StringB_U_BMU_V50_CellBalancer_U_BMU_V50_CellBalanceTaps#44 R?=R?_StringB_U_BMU_V50_CellBalancer_U_BMU_V50_CellBalanceTaps#41 R?=R?_StringB_U_BMU_V50_CellBalancer_U_BMU_V50_CellBalanceTaps#51 R?=R?_StringB_U_BMU_V50_CellBalancer_U_BMU_V50_CellBalanceTaps#36 R?=R?_StringB_U_BMU_V50_CellBalancer_U_BMU_V50_CellBalanceTaps#28 R?=R?_StringB_U_BMU_V50_CellBalancer_U_BMU_V50_CellBalanceTaps#35 R?=R?_StringB_U_BMU_V50_CellBalancer_U_BMU_V50_CellBalanceTaps#46 R?=R?_StringB_U_BMU_V50_CellBalancer_U_BMU_V50_CellBalanceTaps#56 R?=R?_StringB_U_BMU_V50_CellBalancer_U_BMU_V50_CellBalanceTaps#43 R?=R?_StringB_U_BMU_V50_CellBalancer_U_BMU_V50_CellBalanceTaps#31 R?=R?_StringB_U_BMU_V50_CellBalancer_U_BMU_V50_CellBalanceTaps#54 R?=R?_StringB_U_BMU_V50_CellBalancer_U_BMU_V50_CellBalanceTaps#52 R?=R?_StringB_U_BMU_V50_CellBalancer_U_BMU_V50_CellBalanceTaps#32 R?=R?_StringB_U_BMU_V50_CellBalancer_U_BMU_V50_CellBalanceTaps#48 R?=R?_StringB_U_BMU_V50_CellBalancer_U_BMU_V50_CellBalanceTaps#39 R?=R?_StringB_U_BMU_V50_CellBalancer_U_BMU_V50_CellBalanceTaps#25 R?=R?_StringB_U_BMU_V50_CellBalancer_U_BMU_V50_CellBalanceTaps#24 R?=R?_StringB_U_BMU_V50_CellBalancer_U_BMU_V50_CellBalanceTaps#18 R?=R?_StringB_U_BMU_V50_CellBalancer_U_BMU_V50_CellBalanceTaps#13 R?=R?_StringB_U_BMU_V50_CellBalancer_U_BMU_V50_CellBalanceTaps#1 R?=R?_StringB_U_BMU_V50_CellBalancer_U_BMU_V50_CellBalanceTaps#11 R?=R?_StringB_U_BMU_V50_CellBalancer_U_BMU_V50_CellBalanceTaps#21 R?=R?_StringB_U_BMU_V50_CellBalancer_U_BMU_V50_CellBalanceTaps#6 R?=R?_StringB_U_BMU_V50_CellBalancer_U_BMU_V50_CellBalanceTaps#9 R?=R?_StringB_U_BMU_V50_CellBalancer_U_BMU_V50_CellBalanceTaps#16 R?=R?_StringB_U_BMU_V50_CellBalancer_U_BMU_V50_CellBalanceTaps#55 R?=R?_StringB_U_BMU_V50_CellBalancer_U_BMU_V50_CellBalanceTaps#53 R?=R?_StringB_U_BMU_V50_CellBalancer_U_BMU_V50_CellBalanceTaps#47 R?=R?_StringB_U_BMU_V50_CellBalancer_U_BMU_V50_CellBalanceTaps#59 R?=R?_StringB_U_BMU_V50_CellBalancer_U_BMU_V50_CellBalanceTaps#42 R?=R?_StringB_U_BMU_V50_CellBalancer_U_BMU_V50_CellBalanceTaps#38 R?=R?_StringB_U_BMU_V50_CellBalancer_U_BMU_V50_CellBalanceTaps#40 R?=R?_StringB_U_BMU_V50_CellBalancer_U_BMU_V50_CellBalanceTaps#58 R?=R?_StringB_U_BMU_V50_CellBalancer_U_BMU_V50_CellBalanceTaps#49 R?=R?_StringB_U_BMU_V50_CellBalancer_U_BMU_V50_CellBalanceTaps#34 R?=R?_StringB_U_BMU_V50_CellBalancer_U_BMU_V50_CellBalanceTaps#61 R?=R?_StringB_U_BMU_V50_CellBalancer_U_BMU_V50_CellBalanceTaps#60 R?=R?_StringB_U_BMU_V50_CellBalancer_U_BMU_V50_CellBalanceTaps#37 R?=R?_StringB_U_BMU_V50_CellBalancer_U_BMU_V50_CellBalanceTaps#57 R?=R?_StringB_U_BMU_V50_CellBalancer_U_BMU_V50_CellBalanceTaps#50 R?=R?_StringB_U_BMU_V50_CellBalancer_U_BMU_V50_CellBalanceTaps#30 R?=R?_StringB_U_BMU_V50_CellBalancer_U_BMU_V50_CellBalanceTaps#29 R?=R?_StringB_U_BMU_V50_CellBalancer_U_BMU_V50_CellBalanceTaps#23 R?=R?_StringB_U_BMU_V50_CellBalancer_U_BMU_V50_CellBalanceTaps#26 R?=R?_StringB_U_BMU_V50_CellBalancer_U_BMU_V50_CellBalanceTaps#5 R?=R?_StringB_U_BMU_V50_CellBalancer_U_BMU_V50_CellBalanceTaps#10 R?=R?_StringB_U_BMU_V50_CellBalancer_U_BMU_V50_CellBalanceTaps#14 R?=R?_StringB_U_BMU_V50_CellBalancer_U_BMU_V50_CellBalanceTaps#8 R?=R?_StringB_U_BMU_V50_CellBalancer_U_BMU_V50_CellBalanceTaps#15 R?=R?_StringB_U_BMU_V50_CellBalancer_U_BMU_V50_CellBalanceTaps#2 R?=R?_StringB_U_BMU_V50_CellBalancer_U_BMU_V50_CellBalanceTaps#19 R?=R?_StringB_U_BMU_V50_CellBalancer_U_BMU_V50_CellBalanceTaps#27 R?=R?_StringB_U_BMU_V50_CellBalancer_U_BMU_V50_CellBalanceTaps#33 R?=R?_StringB_U_BMU_V50_CellBalancer_U_BMU_V50_CellBalanceTaps#20 R?=R?_StringB_U_BMU_V50_CellBalancer_U_BMU_V50_CellBalanceTaps#3 R?=R?_StringB_U_BMU_V50_CellBalancer_U_BMU_V50_CellBalanceTaps#12 R?=R?_StringB_U_BMU_V50_CellBalancer_U_BMU_V50_CellBalanceTaps#17 R?=R?_StringB_U_BMU_V50_CellBalancer_U_BMU_V50_CellBalanceTaps#7 R?=R?_StringB_U_BMU_V50_CellBalancer_U_BMU_V50_CellBalanceTaps#4 R?=R?_StringB_U_BMU_V50_CellBalancer_U_BMU_V50_CellBalanceTaps#22; ports B0=NetC?_StringB_U_BMU_V50_CellBalancer_U_BMU_V50_CellBalanceTaps#30_2 B1=NetC?_StringB_U_BMU_V50_CellBalancer_U_BMU_V50_CellBalanceTaps#26_2 B2=NetC?_StringB_U_BMU_V50_CellBalancer_U_BMU_V50_CellBalanceTaps#20_2 B3=NetC?_StringB_U_BMU_V50_CellBalancer_U_BMU_V50_CellBalanceTaps#15_2 B4=NetC?_StringB_U_BMU_V50_CellBalancer_U_BMU_V50_CellBalanceTaps#8_2 B5=NetC?_StringB_U_BMU_V50_CellBalancer_U_BMU_V50_CellBalanceTaps#8_1 B6=NetC?_StringB_U_BMU_V50_CellBalancer_U_BMU_V50_CellBalanceTaps#31_2 B7=NetC?_StringB_U_BMU_V50_CellBalancer_U_BMU_V50_CellBalanceTaps#24_2 B8=NetC?_StringB_U_BMU_V50_CellBalancer_U_BMU_V50_CellBalanceTaps#18_2 B9=NetC?_StringB_U_BMU_V50_CellBalancer_U_BMU_V50_CellBalanceTaps#5_2 B10=NetC?_StringB_U_BMU_V50_CellBalancer_U_BMU_V50_CellBalanceTaps#4_1 B11=NetC?_StringB_U_BMU_V50_CellBalancer_U_BMU_V50_CellBalanceTaps#6_2 B12=NetC?_StringB_U_BMU_V50_CellBalancer_U_BMU_V50_CellBalanceTaps#3_1 CB1=NetR?_StringB_U_BMU_V50_CellBalancer_U_BMU_V50_CellBalanceTaps#52_2 CB2=NetR?_StringB_U_BMU_V50_CellBalancer_U_BMU_V50_CellBalanceTaps#44_2 CB3=NetR?_StringB_U_BMU_V50_CellBalancer_U_BMU_V50_CellBalanceTaps#35_2 CB4=NetR?_StringB_U_BMU_V50_CellBalancer_U_BMU_V50_CellBalanceTaps#24_2 CB5=NetR?_StringB_U_BMU_V50_CellBalancer_U_BMU_V50_CellBalanceTaps#11_2 CB6=NetR?_StringB_U_BMU_V50_CellBalancer_U_BMU_V50_CellBalanceTaps#60_2 CB7=NetR?_StringB_U_BMU_V50_CellBalancer_U_BMU_V50_CellBalanceTaps#53_2 CB8=NetR?_StringB_U_BMU_V50_CellBalancer_U_BMU_V50_CellBalanceTaps#40_2 CB9=NetR?_StringB_U_BMU_V50_CellBalancer_U_BMU_V50_CellBalanceTaps#29_2 CB10=NetR?_StringB_U_BMU_V50_CellBalancer_U_BMU_V50_CellBalanceTaps#8_2 CB11=NetR?_StringB_U_BMU_V50_CellBalancer_U_BMU_V50_CellBalanceTaps#22_2 CB12=NetR?_StringB_U_BMU_V50_CellBalancer_U_BMU_V50_CellBalanceTaps#7_2 VC0=NetC?_StringB_U_BMU_V50_CellBalancer_U_BMU_V50_CellBalanceTaps#33_1 VC1=NetC?_StringB_U_BMU_V50_CellBalancer_U_BMU_V50_CellBalanceTaps#28_1 VC2=NetC?_StringB_U_BMU_V50_CellBalancer_U_BMU_V50_CellBalanceTaps#23_1 VC3=NetC?_StringB_U_BMU_V50_CellBalancer_U_BMU_V50_CellBalanceTaps#17_1 VC4=NetC?_StringB_U_BMU_V50_CellBalancer_U_BMU_V50_CellBalanceTaps#11_1 VC5=NetC?_StringB_U_BMU_V50_CellBalancer_U_BMU_V50_CellBalanceTaps#2_1 VC6=NetC?_StringB_U_BMU_V50_CellBalancer_U_BMU_V50_CellBalanceTaps#35_1 VC7=NetC?_StringB_U_BMU_V50_CellBalancer_U_BMU_V50_CellBalanceTaps#29_1 VC8=NetC?_StringB_U_BMU_V50_CellBalancer_U_BMU_V50_CellBalanceTaps#22_1 VC9=NetC?_StringB_U_BMU_V50_CellBalancer_U_BMU_V50_CellBalanceTaps#10_1 VC10=NetC?_StringB_U_BMU_V50_CellBalancer_U_BMU_V50_CellBalanceTaps#7_1 VC11=NetC?_StringB_U_BMU_V50_CellBalancer_U_BMU_V50_CellBalanceTaps#12_1 VC12=NetC?_StringB_U_BMU_V50_CellBalancer_U_BMU_V50_CellBalanceTaps#1_1

### Notes on the sheet
- Title
- MATTERNET
- PROPRIETRY & CONFIDENTIAL
  THE INFORMATION CONTAINS IN THIS DRAWING
  IS THE SOLE PROPERTY OF  MATTERNET Inc.
  ANY REPRODUCTION IN PART OR AS WHOLE
  WITHOUT A WRITTEN PERMISSION OF
  MATTERNET Inc. IS PROHIBITED
- Size:
- Date:
- File:
- C
- Number:
- Time:
- Revision:
- Sheet
- of
- 161 E. Evelyn Ave.
- Mountain View,
- CA 94041 USA

### Library data of the parts
C?#1 C?#2 C?#7 C?#10-C?#12 C?#17 C?#22 C?#23 C?#28 C?#29 C?#33 C?#35 = CAP-Generic-0402: CAP CER 0.022UF 100V X7R 0603; Manufacturer: Murata; Manufacturer Part Number: GCJ188R72A223KA01D; Capacitance: 22nF; Tolerance: 10%; ComponentLink1URL: http://www.mouser.com/ds/2/212/KEM_C1002_X7R_SMD-1102033.pdf; ComponentLink1Description: http://www.mouser.com/ds/2/212/KEM_C1002_X7R_SMD-1102033.pdf; ComponentLink2URL: https://www.verical.com/server-webapp/html/getDatasheet?partID=38414; ComponentLink2Description: https://www.verical.com/server-webapp/html/getDatasheet?partID=38414; Supplier 1: Digi-Key; Supplier Part Number 1: 490-5769-1-ND; Stock 1: 480265; Pricing 1: 1=0.4, 10=0.277, 100=0.1572, 500=0.11096, 1000=0.0971 (USD); Mount: Surface Mount; Case/Package: 0603; Case Code (Metric): 1608; Case Code (Imperial): 0603; Min Operating Temperature: -55°C; Max Operating Temperature: 125°C; Dielectric: X7R; Package Quantity: 4000; Voltage Rating: 100V; Packaging: Tape and Reel; Termination: SMD/SMT; Voltage Rating (DC): 100V; Features: Soft Termination; Length: 1.6mm; Height: 0.8mm; Width: 0.031inch; Thickness: 0.031inch; Depth: 0.8mm; Ratings: AEC-Q200; Radiation Hardening: No; Lead Free: Lead Free; ComponentLink3URL: https://www.murata.com/~/media/webrenewal/support/library/catalog/products/capacitor/mlcc/c03e.ashx?la=en-us&src-supplier=Digi-Key; ComponentLink3Description: https://www.murata.com/~/media/webrenewal/support/library/catalog/products/capacitor/mlcc/c03e.ashx?la=en-us&src-supplier=Digi-Key; ComponentLink4URL: http://search.murata.co.jp/Ceramy/image/img/A01X/partnumbering_e_02.pdf?src-supplier=Digi-Key; ComponentLink4Description: http://search.murata.co.jp/Ceramy/image/img/A01X/partnumbering_e_02.pdf?src-supplier=Digi-Key
C?#3 C?#4 C?#9 C?#13 C?#16 C?#19 C?#21 C?#25 C?#27 C?#32 C?#34 C?#37 = CAP-Generic-0603: CAP CER 10000PF 50V X7R 0603; Manufacturer: TDK; Manufacturer Part Number: CGA3E2X7R1H103K080AE; Capacitance: 10nF; Tolerance: 10%; Supplier 1: Digi-Key; Supplier Part Number 1: 445-15955-1-ND; Stock 1: 42633; Pricing 1: 1=0.27, 10=0.186, 100=0.0944, 500=0.06458, 1000=0.05713 (USD); Mount: Surface Mount; Case/Package: 0603; Weight: 7.1E-05oz; Case Code (Metric): 1608; Case Code (Imperial): 0603; Min Operating Temperature: -55°C; Max Operating Temperature: 125°C; Package Quantity: 4000; Packaging: Tape and Reel; Voltage Rating: 50V; Dielectric: X7R; Termination: SMD/SMT; Voltage Rating (DC): 50V; Features: Soft Termination; Length: 0.063inch; Height: 0.8mm; Width: 0.031inch; Thickness: 0.035inch; Ratings: AEC-Q200
C?#5 C?#6 C?#8 C?#14 C?#15 C?#18 C?#20 C?#24 C?#26 C?#30 C?#31 C?#36 = CAP-Generic-0603: CAP CER 0.1UF 50V 10% X7R 0603; Manufacturer: Murata; Manufacturer Part Number: GCJ188R71E104KA12D; Supplier 1: Digi-Key; Supplier Part Number 1: 490-16477-1-ND; Stock 1: 2560; Pricing 1: 1=0.22, 10=0.152, 100=0.077, 500=0.0527, 1000=0.04662 (USD); Case/Package: 0603; Supplier 2: Mouser; Supplier Part Number 2: 81-GCJ188R71E104KA2D; Stock 2: 47905; Pricing 2: 1=0.21, 10=0.139, 50=0.139, 100=0.071, 1000=0.043, 10000=0.035 (USD)
D?#1-D?#12 = LED-GENERIC: custinv: Ansync; custprt: 100-0500-000159; Option: AB
Q?#1 Q?#2 Q?#5 = FET-P-CH-Generic_OP4_0: MOSFET P-CH 60V 1.1A SOT-23; Manufacturer: ON Semiconductor; Supplier 1: Digi-Key; Supplier Part Number 1: NVR5124PLT1GOSCT-ND; Manufacturer Part Number: NVR5124PLT1G; Stock 1: 6451; Pricing 1: 1=0.61, 10=0.477, 100=0.3272, 500=0.22434, 1000=0.16826 (USD); Lead Free: Lead Free; Supplier 2: Mouser; Supplier Part Number 2: 863-NVR5124PLT1G; Stock 2: 58977; Pricing 2: 1=0.48, 10=0.366, 50=0.366, 100=0.198, 1000=0.149, 10000=0.12 (USD)
Q?#3 Q?#4 Q?#6-Q?#12 = FET-NCH-GenericOp2: MOSFET N-CH 60V 280MA SOT-23; Manufacturer: ON Semiconductor / Fairchild; custprt: 100-0300-000088; custinv: Ansync; Option: AB; Drain to Source Resistance: 1.2R; Gate to Source Voltage (Vgs): 20V; Input Capacitance: 50pF; Max Power Dissipation: 300mW; Element Configuration: Single; Rds On Max: 2R; Number of Elements: 1; Threshold Voltage: 2.1V; Current: 28A; Supplier 1: Digi-Key; Supplier Part Number 1: NDS7002ACT-ND; Manufacturer Part Number: NDS7002A; Stock 1: 419; Pricing 1: 1=0.51, 10=0.368, 100=0.2168, 500=0.1227, 1000=0.09407 (USD); Mount: Surface Mount; Case/Package: SOT-23; Number of Pins: 3; Contact Plating: Matte,Tin; Min Operating Temperature: -65°C; Max Operating Temperature: 150°C; Continuous Drain Current (ID): 280mA; Packaging: Tape and Reel; Drain to Source Voltage (Vdss): 60V; Drain to Source Breakdown Voltage: 60V; Power Dissipation: 300mW; Package Quantity: 1; Voltage Rating (DC): 60V; Current Rating: 280mA; On-State Resistance: 2R; Nominal Vgs: 2.1V; Dual Supply Voltage: 60V; Voltage: 60V; Width: 3.05mm; Radiation Hardening: No; Lead Free: Lead Free; REACH SVHC: No SVHC; ComponentLink1URL: https://www.fairchildsemi.com/package-drawings/MA/MA03B.pdf; ComponentLink1Description: https://www.fairchildsemi.com/package-drawings/MA/MA03B.pdf; ComponentLink2URL: https://www.verical.com/server-webapp/html/getDatasheet?partID=44394; ComponentLink2Description: https://www.verical.com/server-webapp/html/getDatasheet?partID=44394; ComponentLink3URL: https://www.fairchildsemi.com/datasheets/ND/NDS7002A.pdf; ComponentLink3Description: https://www.fairchildsemi.com/datasheets/ND/NDS7002A.pdf; ComponentLink4URL: http://www.farnell.com/datasheets/660093.pdf; ComponentLink4Description: http://www.farnell.com/datasheets/660093.pdf; ComponentLink5URL: http://www.jameco.com/Jameco/Products/ProdDS/874832.pdf; ComponentLink5Description: http://www.jameco.com/Jameco/Products/ProdDS/874832.pdf; ComponentLink6URL: http://www.fairchildsemi.com/ds/ND/NDS7002A.pdf; ComponentLink6Description: http://www.fairchildsemi.com/ds/ND/NDS7002A.pdf; Supplier 2: Mouser; Supplier Part Number 2: 512-NDS7002A; Stock 2: 2771; Pricing 2: 1=0.41, 10=0.261, 50=0.261, 100=0.112, 1000=0.086, 10000=0.058 (USD)
R?#1 R?#2 R?#4 R?#9 R?#10 R?#12 R?#15 R?#16 R?#20 R?#21 R?#26-R?#28 R?#32 R?#37-R?#39 R?#43 R?#46 R?#49-R?#51 R?#56 R?#58 R?#59 = R-Generic-0402: RES SMD 1K OHM 5% 1/16W 0402; Manufacturer: Yageo; Manufacturer Part Number: RC0402JR-071KL; custinv: Ansync; custprt: 100-0120-000074; Option: AB; Resistance: 1kR; Power Rating: 62.5mW; Voltage Rating: 50V; Temperature Coefficient: 100ppm/°C; Max Power Dissipation: 63mW; Supplier 1: Digi-Key; Supplier Part Number 1: 311-1.0KJRCT-ND; Stock 1: 18546768; Pricing 1: 1=0.1, 10=0.015, 100=0.006, 1000=0.00268, 2500=0.00233, 5000=0.00192 (USD); Case/Package: 0402; Case Code (Imperial): 0402; Case Code (Metric): 1005; Min Operating Temperature: -55°C; Max Operating Temperature: 155°C; Tolerance: 5%; Packaging: Tape and Reel; Package Quantity: 1; Termination: SMD/SMT; Composition: Thick Film; Number of Terminations: 2; Military Standard: Not; Features: Moisture Resistant; Length: 0.039inch; Height: 0.016inch; Width: 0.02inch; Depth: 0.5mm; REACH SVHC: No SVHC; Lead Free: Lead Free; ComponentLink1URL: http://www.yageo.com/documents/recent/PYu-RC_Group_51_RoHS_L_9.pdf; ComponentLink1Description: http://www.yageo.com/documents/recent/PYu-RC_Group_51_RoHS_L_9.pdf; ComponentLink2URL: http://www.farnell.com/datasheets/1018594.pdf; ComponentLink2Description: http://www.farnell.com/datasheets/1018594.pdf; ComponentLink3URL: http://www.yageo.com/documents/recent/PYu-RC0402_51_RoHS_L_6_r.pdf; ComponentLink3Description: http://www.yageo.com/documents/recent/PYu-RC0402_51_RoHS_L_6_r.pdf
R?#3 R?#5 R?#13 R?#19 R?#25 R?#30 R?#36 R?#42 R?#45 R?#54 R?#55 R?#61 = R-Generic-0603: RES SMD 330K OHM 5% 1/10W 0603; Manufacturer: Yageo; Manufacturer Part Number: RC0603JR-07330KL; custprt: 100-0110-000011; custinv: Ansync; Option: AB; Resistance: 330kR; Power Rating: 100mW; Voltage Rating: 75V; Voltage Rating (DC): 50V; Temperature Coefficient: 100ppm/°C; Supplier 1: Digi-Key; Supplier Part Number 1: 311-330KGRCT-ND; Stock 1: 271870; Pricing 1: 1=0.1, 10=0.022, 100=0.0088, 1000=0.00396, 2500=0.00344 (USD); Case/Package: 0603; Number of Pins: 2; Weight: 7.1E-05oz; Case Code (Imperial): 0603; Case Code (Metric): 1608; Min Operating Temperature: -55°C; Max Operating Temperature: 155°C; Tolerance: 5%; Packaging: Tape and Reel; Package Quantity: 1; Termination: SMD/SMT; Composition: Thick Film; Number of Terminations: 2; Military Standard: Not; Max Power Dissipation: 100mW; Features: Moisture Resistant; Length: 1.6mm; Height: 0.022inch; Width: 0.8mm; Depth: 0.8mm; REACH SVHC: No SVHC; Lead Free: Lead Free; ComponentLink1URL: http://www.yageo.com/documents/recent/PYu-RC_Group_51_RoHS_L_9.pdf; ComponentLink1Description: http://www.yageo.com/documents/recent/PYu-RC_Group_51_RoHS_L_9.pdf; ComponentLink2URL: http://www.farnell.com/datasheets/443971.pdf; ComponentLink2Description: http://www.farnell.com/datasheets/443971.pdf; ComponentLink3URL: https://www.verical.com/server-webapp/html/getDatasheet?partID=323834; ComponentLink3Description: https://www.verical.com/server-webapp/html/getDatasheet?partID=323834
R?#6 R?#14 R?#17 R?#18 R?#23 R?#31 R?#33 R?#34 R?#41 R?#47 R?#48 R?#57 = R-Generic: RES SMD 42.2 OHM 1% 1.5W 2512; Manufacturer: Vishay Dale; Manufacturer Part Number: CRCW251242R2FKEGHP; custprt: 100-0100-000214; custinv: Ansync; Option: AB; Resistance: 42.2R; Temperature Coefficient: 100ppm/°C; Supplier 1: Digi-Key; Supplier Part Number 1: 541-42.2RCT-ND; Stock 1: 1751; Pricing 1: 1=0.74, 10=0.618, 100=0.4152, 1000=0.27302 (USD); Case/Package: 2512; Case Code (Metric): 6432; Case Code (Imperial): 2512; Min Operating Temperature: -55°C; Max Operating Temperature: 155°C; Package Quantity: 2000; Packaging: Tape and Reel; Composition: Thick Film; Number of Terminations: 2; Tolerance: 1%; Max Power Dissipation: 1.5W; Features: Automotive AEC-Q200; Length: 0.248inch; Height: 0.028inch; Width: 0.124inch; Lead Free: Lead Free
R?#7 R?#8 R?#11 R?#22 R?#24 R?#29 R?#35 R?#40 R?#44 R?#52 R?#53 R?#60 = R-Generic-0402: RES SMD 10K OHM 1% 1/16W 0402; Manufacturer: Vishay Dale; Manufacturer Part Number: CRCW040210K0FKTD; Resistance: 10kR; Power Rating: 63mW; Voltage Rating: 50V; Temperature Coefficient: 100ppm/°C; ComponentLink1URL: http://www.yageo.com/documents/recent/PYu-RC_Group_51_RoHS_L_9.pdf; ComponentLink1Description: http://www.yageo.com/documents/recent/PYu-RC_Group_51_RoHS_L_9.pdf; ComponentLink2URL: http://www.mouser.com/ds/2/447/PYu-RC0402_51_RoHS_L_6_r-8721.pdf; ComponentLink2Description: http://www.mouser.com/ds/2/447/PYu-RC0402_51_RoHS_L_6_r-8721.pdf; ComponentLink3URL: http://www.farnell.com/datasheets/1018594.pdf; ComponentLink3Description: http://www.farnell.com/datasheets/1018594.pdf; Supplier 1: Digi-Key; Supplier Part Number 1: 541-2955-1-ND; Stock 1: 17223; Pricing 1: 1=0.15, 10=0.132, 100=0.0508, 1000=0.02236, 2500=0.01931, 5000=0.01728 (USD); Mount: Surface Mount; Case/Package: 0402; Number of Pins: 2; Weight: 2.3E-05oz; Case Code (Metric): 1005; Case Code (Imperial): 0402; Contact Plating: Lead,Tin; Min Operating Temperature: -55°C; Max Operating Temperature: 155°C; Tolerance: 1%; Packaging: Tape and Reel; Package Quantity: 10000; Composition: Thick Film; Number of Terminations: 2; Military Standard: Not; Max Power Dissipation: 63mW; Voltage Rating (DC): 50V; Features: Automotive AEC-Q200; Length: 1mm; Height: 0.016inch; Width: 0.02inch; Depth: 0.5mm; Radiation Hardening: No; Lead Free: Contains Lead; REACH SVHC: Unknown; ComponentLink4URL: http://www.vishay.com/docs/20008/dcrcw.pdf?src-supplier=Digi-Key; ComponentLink4Description: http://www.vishay.com/docs/20008/dcrcw.pdf?src-supplier=Digi-Key; ComponentLink5URL: https://www.verical.com/server-webapp/html/getDatasheet?partID=104182&src-supplier=Verical; ComponentLink5Description: https://www.verical.com/server-webapp/html/getDatasheet?partID=104182&src-supplier=Verical; ComponentLink6URL: http://www.vishay.com/docs/20008/dcrcw.pdf?src-supplier=Avnet; ComponentLink6Description: http://www.vishay.com/docs/20008/dcrcw.pdf?src-supplier=Avnet